# Altium schematic sheet ESP32.SchDoc
size A3; Author: Van Hieu; Organization: BACH-KHOA-DK; SheetNumber: 6; SheetTotal: 6; Gmail: maivanhieu24042003@gmail.com
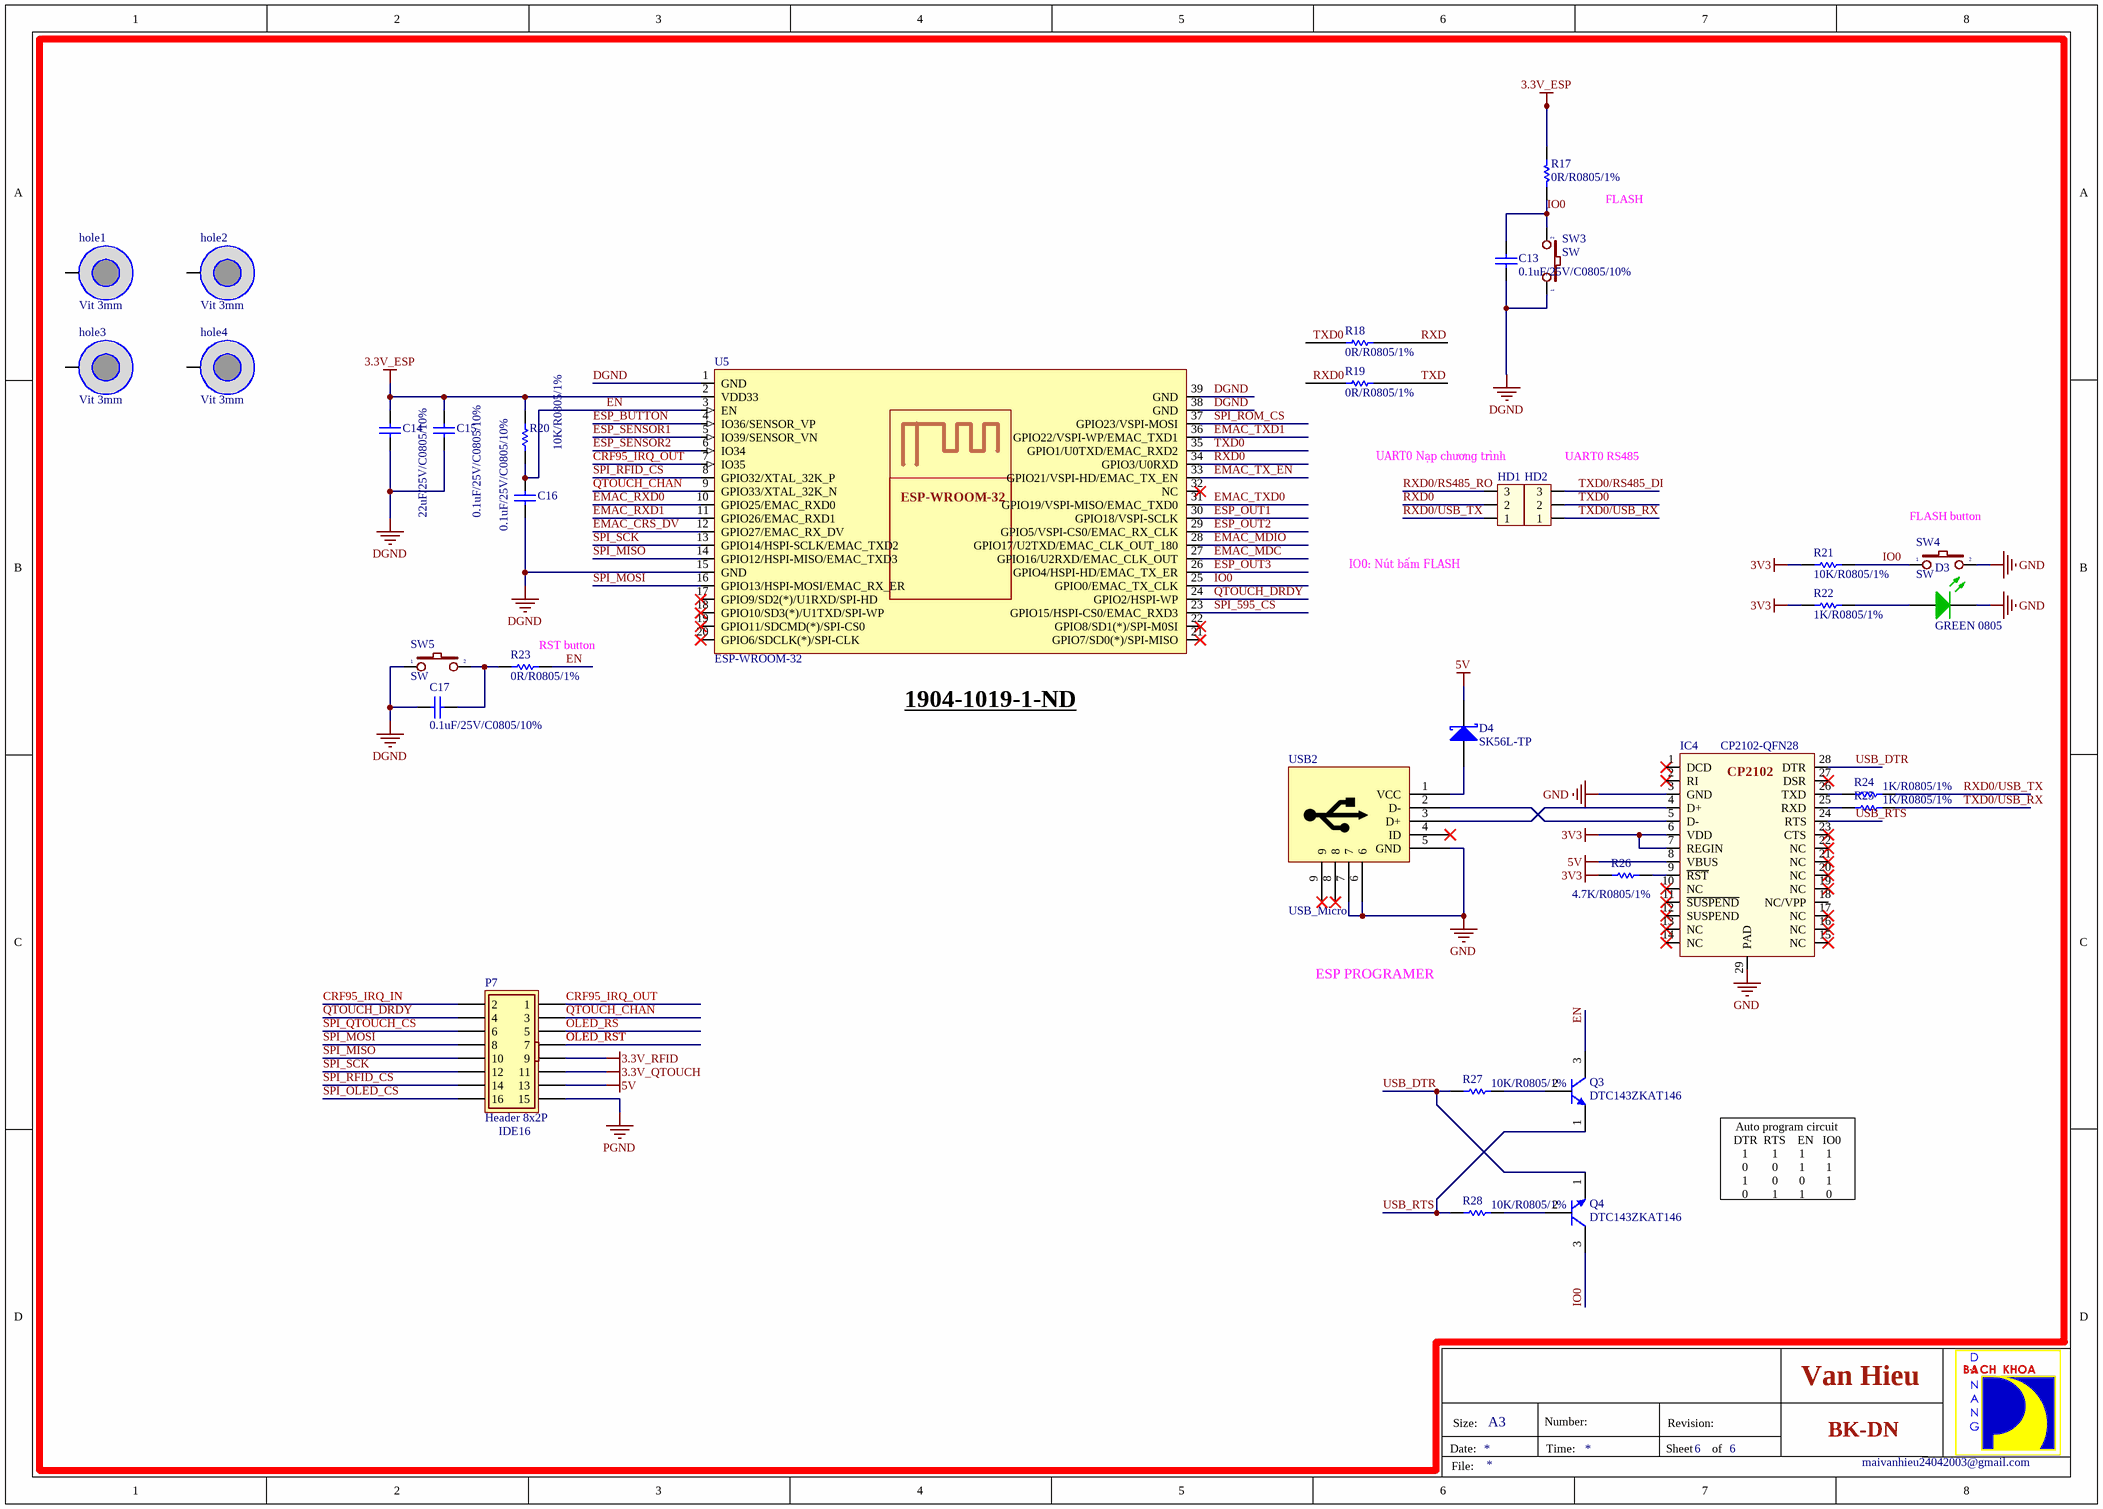
[diagram p0: ESP32.SchDoc]

## Parts
C13  0.1uF/25V/C0805/10%  [CAP_CERA_C2012(CC0805INCH)]
C14  22uF/25V/C0805/10%  [CAP_CERA_C2012(CC0805INCH)]
C15  0.1uF/25V/C0805/10%  [CAP_CERA_C2012(CC0805INCH)]
C16  0.1uF/25V/C0805/10%  [CAP_CERA_C2012(CC0805INCH)]
C17  0.1uF/25V/C0805/10%  [CAP_CERA_C2012(CC0805INCH)]
D3  GREEN 0805  [Led 0805G]
D4  SK56L-TP  [30# SK56L-TPMSCT-ND]
HD1  Header 3  [Header_3]  (value not drawn)
HD2  Header 3  [Header_3]  (value not drawn)
hole1  Vit 3mm  [Screw 3.0]
hole2  Vit 3mm  [Screw 3.0]
hole3  Vit 3mm  [Screw 3.0]
hole4  Vit 3mm  [Screw 3.0]
IC4  CP2102-QFN28  [CP2102]
P7  Header 8x2P  [Header IDE16 8x2 -]
Q3  DTC143ZKAT146  [6# DTC143ZKAT146-E]
Q4  DTC143ZKAT146  [6# DTC143ZKAT146-E]
R17  0R/R0805/1%  [Res 0805 SMD]
R18  0R/R0805/1%  [Res 0805 SMD]
R19  0R/R0805/1%  [Res 0805 SMD]
R20  10K/R0805/1%  [Res 0805 SMD]
R21  10K/R0805/1%  [Res 0805 SMD]
R22  1K/R0805/1%  [Res 0805 SMD]
R23  0R/R0805/1%  [Res 0805 SMD]
R24  1K/R0805/1%  [Res 0805 SMD]
R25  1K/R0805/1%  [Res 0805 SMD]
R26  4.7K/R0805/1%  [Res 0805 SMD]
R27  10K/R0805/1%  [Res 0805 SMD]
R28  10K/R0805/1%  [Res 0805 SMD]
SW3  SW  [BUTTON 2PIN TRON]
SW4  SW  [BUTTON 2PIN TRON]
SW5  SW  [BUTTON 2PIN TRON]
U5  ESP-WROOM-32  [ESP32 WROOM]
USB2  USB_Micro  [USBMNIB]

## Nets
3.3V_ESP: C14.2 C15.2 R17.2 R20.1 U5.2(VDD33)
3.3V_QTOUCH: P7.11
3.3V_RFID: P7.9
3V3: IC4.6(VDD) IC4.7(REGIN) R21.1 R22.1 R26.1
5V: D4.2(K) IC4.8(VBUS) P7.13
DGND: C13.2 C14.1 C15.1 C16.1 C17.2 SW3.1 SW5.1 U5.1(GND) U5.15(GND) U5.38(GND) U5.39(GND)
GND: D3.2(K) IC4.3(GND) IC4.29(PAD) SW4.2 USB2.5(GND) USB2.6 USB2.7
PGND: P7.15
CRF95_IRQ_IN: P7.2
CRF95_IRQ_OUT: P7.1 U5.7(IO35)
EMAC_CRS_DV: U5.12(GPIO27/EMAC_RX_DV)
EMAC_MDC: U5.27(GPIO16/U2RXD/EMAC_CLK_OUT)
EMAC_MDIO: U5.28(GPIO17/U2TXD/EMAC_CLK_OUT_180)
EMAC_RXD0: U5.10(GPIO25/EMAC_RXD0)
EMAC_RXD1: U5.11(GPIO26/EMAC_RXD1)
EMAC_TX_EN: U5.33(GPIO21/VSPI-HD/EMAC_TX_EN)
EMAC_TXD0: U5.31(GPIO19/VSPI-MISO/EMAC_TXD0)
EMAC_TXD1: U5.36(GPIO22/VSPI-WP/EMAC_TXD1)
EN: C16.2 Q3.3(C) R20.2 R23.2 U5.3(EN)
ESP_BUTTON: U5.4(IO36/SENSOR_VP)
ESP_OUT1: U5.30(GPIO18/VSPI-SCLK)
ESP_OUT2: U5.29(GPIO5/VSPI-CS0/EMAC_RX_CLK)
ESP_OUT3: U5.26(GPIO4/HSPI-HD/EMAC_TX_ER)
ESP_SENSOR1: U5.5(IO39/SENSOR_VN)
ESP_SENSOR2: U5.6(IO34)
IO0: C13.1 Q4.3(C) R17.1 R21.2 SW3.2 SW4.1 U5.25(GPIO0/EMAC_TX_CLK)
OLED_RS: P7.5
OLED_RST: P7.7
QTOUCH_CHAN: P7.3 U5.9(GPIO33/XTAL_32K_N)
QTOUCH_DRDY: P7.4 U5.24(GPIO2/HSPI-WP)
RXD: R18.1
RXD0: HD1.2 R19.2 U5.34(GPIO3/U0RXD)
RXD0/RS485_RO: HD1.3
RXD0/USB_TX: HD1.1 R24.1
SPI_595_CS: U5.23(GPIO15/HSPI-CS0/EMAC_RXD3)
SPI_MISO: P7.10 U5.14(GPIO12/HSPI-MISO/EMAC_TXD3)
SPI_MOSI: P7.8 U5.16(GPIO13/HSPI-MOSI/EMAC_RX_ER)
SPI_OLED_CS: P7.16
SPI_QTOUCH_CS: P7.6
SPI_RFID_CS: P7.14 U5.8(GPIO32/XTAL_32K_P)
SPI_ROM_CS: U5.37(GPIO23/VSPI-MOSI)
SPI_SCK: P7.12 U5.13(GPIO14/HSPI-SCLK/EMAC_TXD2)
TXD: R19.1
TXD0: HD2.2 R18.2 U5.35(GPIO1/U0TXD/EMAC_RXD2)
TXD0/RS485_DI: HD2.3
TXD0/USB_RX: HD2.1 R25.1
USB_DTR: IC4.28(DTR) Q4.1(E) R27.2
USB_RTS: IC4.24(RTS) Q3.1(E) R28.2
NetC17_1: C17.1 R23.1 SW5.2
NetD3_1: D3.1(A) R22.2
NetD4_1: D4.1(A) USB2.1(VCC)
NetIC4_4: IC4.4(D+) USB2.3(D+)
NetIC4_5: IC4.5(D-) USB2.2(D-)
NetIC4_9: IC4.9(~{RST}) R26.2
NetIC4_25: IC4.25(RXD) R25.2
NetIC4_26: IC4.26(TXD) R24.2
NetQ3_2: Q3.2(B) R27.1
NetQ4_2: Q4.2(B) R28.1

Not connected (* = marked no-connect by the designer): hole1 1(hole); hole2 1(hole); hole3 1(hole); hole4 1(hole); IC4 1(DCD)* 2(RI)* 10(NC)* 11(~{SUSPEND})* 12(SUSPEND)* 13(NC)* 14(NC)* 15(NC)* 16(NC)* 17(NC)* 18(NC/VPP) 19(NC)* 20(NC)* 21(NC)* 22(NC)* 23(CTS)* 27(DSR)*; U5 17(GPIO9/SD2(*)/U1RXD/SPI-HD)* 18(GPIO10/SD3(*)/U1TXD/SPI-WP)* 19(GPIO11/SDCMD(*)/SPI-CS0)* 20(GPIO6/SDCLK(*)/SPI-CLK)* 21(GPIO7/SD0(*)/SPI-MISO)* 22(GPIO8/SD1(*)/SPI-M0SI)* 32(NC)*; USB2 4(ID)* 8* 9*

## Notes on the sheet
- FLASH
- (near HD1) UART0 Nạp chương trình
- (near HD2) UART0 RS485
- (near SW4) FLASH button
- IO0: Nút bấm FLASH
- (near R23) RST button
- (near U5) 1904-1019-1-ND
- ESP PROGRAMER
- (near P7) IDE16
- Auto program circuit
  DTR  RTS    EN   IO0
  1        1       1       1
  0        0       1       1
  1        0       0       1
  0        1       1       0
- Van Hieu
- Date:
- Size:
- A3
- Number:
- Time:
- Sheet
- Revision:
- of
- BK-DN
- File:
- maivanhieu24042003@gmail.com

## Library data of the parts
C13 C15-C17 = 0.1uF/50V/C0603/10%: 0.1µF ±10% 25V Ceramic Capacitor X7R 0805 (2012 Metric); ComponentLink1URL: http://www.murata.com/~/media/webrenewal/support/library/catalog/products/capacitor/mlcc/c02e.ashx; ComponentLink1Description: http://www.murata.com/~/media/webrenewal/support/library/catalog/products/capacitor/mlcc/c02e.ashx; Digikey: 478-3755-1-ND
C14 = 0.1uF/50V/C0603/10%: 22µF ±20% 25V Ceramic Capacitor X5R 0805 (2012 Metric); Manufacturer: Tariff Applied; ComponentLink1URL: http://www.murata.com/~/media/webrenewal/support/library/catalog/products/capacitor/mlcc/c02e.ashx; ComponentLink1Description: http://www.murata.com/~/media/webrenewal/support/library/catalog/products/capacitor/mlcc/c02e.ashx; Digikey: 1276-2908-1-ND
D3 = LED GREEN 0603: Green 571nm LED Indication - Discrete 2V 0805 (2012 Metric); ComponentLink1URL: http://optoelectronics.liteon.com/upload/download/DS22-2000-074/S_110_LTST-C190KGKT.pdf; ComponentLink1Description: http://optoelectronics.liteon.com/upload/download/DS22-2000-074/S_110_LTST-C190KGKT.pdf; Digikey: 160-1426-1-ND
D4 = 30# SK56L-TP: DIODE SCHOTTKY 60V 5A DO214AB; ComponentLink1URL: http://www.mccsemi.com/up_pdf/SK52L-SK510L(DO-214AB).PDF; ComponentLink1Description: http://www.mccsemi.com/up_pdf/SK52L-SK510L(DO-214AB).PDF; Digikey: SK56L-TPMSCT-ND
HD1 HD2 = Header3: Value: Header 3
IC4 = CP2102
P7 = Header IDE 8x2P: IDE16 Đực Thẳng 2.54MM; BuyVN: https://banlinhkien.vn/goods-764-ide16-duc-thang-2-54mm.html
Q3 Q4 = 6#DTC143ZKAT146: Pre-Biased Bipolar Transistor (BJT) NPN - Pre-Biased 50V 100mA 250MHz 200mW Surface Mount SMT3; Digikey: DTC143ZKAT146CT-ND
R17 R23 = 200K/R0603/1%: 0 Ohms Jumper 0.125W, 1/8W Chip Resistor 0805 (2012 Metric) Automotive AEC-Q200 Thick Film; Part Status: Active; Height - Seated (Max): 0.022" (0.55mm); Failure Rate: -; ComponentLink1URL: http://www.yageo.com/documents/recent/PYu-RC_Group_51_RoHS_L_7.pdf; ComponentLink1Description: http://www.yageo.com/documents/recent/PYu-RC_Group_51_RoHS_L_7.pdf; Digikey: 541-0.0ACT-ND
R18 R19 = 10K/R0603/1%: 0 Ohms Jumper 0.125W, 1/8W Chip Resistor 0805 (2012 Metric) Automotive AEC-Q200 Thick Film; Resistance (Ohms): 10k; Height: 0.022" (0.55mm); Number of Terminations: 2; ComponentLink1URL: http://www.yageo.com/NewPortal/yageodocoutput?fileName=/pdf/R-Chip/PYu-RC_Group_51_RoHS_L_3.pdf; ComponentLink1Description: http://www.yageo.com/NewPortal/yageodocoutput?fileName=/pdf/R-Chip/PYu-RC_Group_51_RoHS_L_3.pdf; Digikey: 541-0.0ACT-ND
R20 R21 = 200K/R0603/1%: 10 kOhms ±1% 0.125W, 1/8W Chip Resistor 0805 (2012 Metric) Thick Film; Power (Watts): 0.1W, 1/10W; RoHS: RoHS Compliant; Category: Resistors; Part Status: Active; Features: Moisture Resistant; Operating Temperature: -55°C ~ 155°C; Package / Case: 0603 (1608 Metric); Supplier Device Package: 0603; Size / Dimension: 0.063" L x 0.031" W (1.60mm x 0.80mm); Height - Seated (Max): 0.022" (0.55mm); Failure Rate: -; ComponentLink1URL: http://www.yageo.com/documents/recent/PYu-RC_Group_51_RoHS_L_7.pdf; ComponentLink1Description: http://www.yageo.com/documents/recent/PYu-RC_Group_51_RoHS_L_7.pdf; Digikey: A126332CT-ND
R22 = 200K/R0603/1%: 1 kOhms ±1% 0.125W, 1/8W Chip Resistor 0805 (2012 Metric) Automotive AEC-Q200 Thick Film; Power (Watts): 0.1W, 1/10W; RoHS: RoHS Compliant; Category: Resistors; Part Status: Active; Features: Moisture Resistant; Operating Temperature: -55°C ~ 155°C; Package / Case: 0603 (1608 Metric); Supplier Device Package: 0603; Size / Dimension: 0.063" L x 0.031" W (1.60mm x 0.80mm); Height - Seated (Max): 0.022" (0.55mm); Failure Rate: -; ComponentLink1URL: http://www.yageo.com/documents/recent/PYu-RC_Group_51_RoHS_L_7.pdf; ComponentLink1Description: http://www.yageo.com/documents/recent/PYu-RC_Group_51_RoHS_L_7.pdf; Digikey: 541-1.00KCCT-ND
R24 R25 = 34.8K/R0805/1%: 1 kOhms ±1% 0.125W, 1/8W Chip Resistor 0805 (2012 Metric) Automotive AEC-Q200 Thick Film; Power Rating: 100mW; Resistance: 34.8kR; Voltage Rating: 50V; Case/Package: 0603; Case Code (Imperial): 0603; Case Code (Metric): 1608; Min Operating Temperature: -55°C; Max Operating Temperature: 155°C; Termination: SMD/SMT; Military Standard: Not; Voltage Rating (DC): 50V; Length: 1.6mm; Height: 0.45mm; Width: 0.8mm; Depth: 0.8mm; Lead Free: Lead Free; Digikey: 541-1.00KCCT-ND
R26 = 34.8K/R0805/1%: 4.7 kOhms ±1% 0.125W, 1/8W Chip Resistor 0805 (2012 Metric) Thick Film; Digikey: 541-4131-1-ND
R27 R28 = 34.8K/R0805/1%: 10 kOhms ±1% 0.125W, 1/8W Chip Resistor 0805 (2012 Metric) Thick Film; Power Rating: 100mW; Resistance: 34.8kR; Voltage Rating: 50V; Case/Package: 0603; Case Code (Imperial): 0603; Case Code (Metric): 1608; Min Operating Temperature: -55°C; Max Operating Temperature: 155°C; Termination: SMD/SMT; Military Standard: Not; Voltage Rating (DC): 50V; Length: 1.6mm; Height: 0.45mm; Width: 0.8mm; Depth: 0.8mm; Lead Free: Lead Free; Digikey: A126332CT-ND
SW3-SW5 = SW2: Switch button 2 pin; Value: SW chip 2 pin
USB2 = USB_MINI